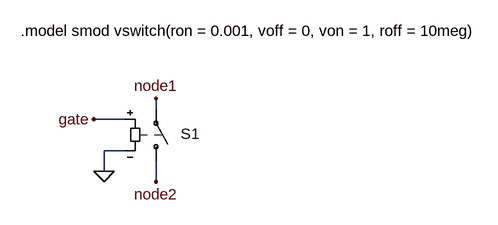
[diagram p0: schematic IDEAL_SW.asc]
IDEAL_SW.asc, the LTspice schematic file:
Version 4
SHEET 1 880 680
WIRE 208 80 208 64
WIRE 160 96 112 96
WIRE 160 144 128 144
WIRE 128 176 128 144
WIRE 208 192 208 160
FLAG 112 96 gate
FLAG 208 64 node1
FLAG 208 192 node2
FLAG 128 176 0
SYMBOL sw 208 176 M180
WINDOW 3 24 104 Invisible 0
WINDOW 0 38 58 Left 0
SYMATTR Value smod
SYMATTR InstName S1
TEXT 0 -40 Left 0 !.model smod vswitch(ron = 0.001, voff = 0, von = 1, roff = 10meg)

The netlist it stands for:
* IDEAL_SW.asc
S1 node2 node1 gate 0 smod
.model smod vswitch(ron = 0.001, voff = 0, von = 1, roff = 10meg)
.backanno
.end